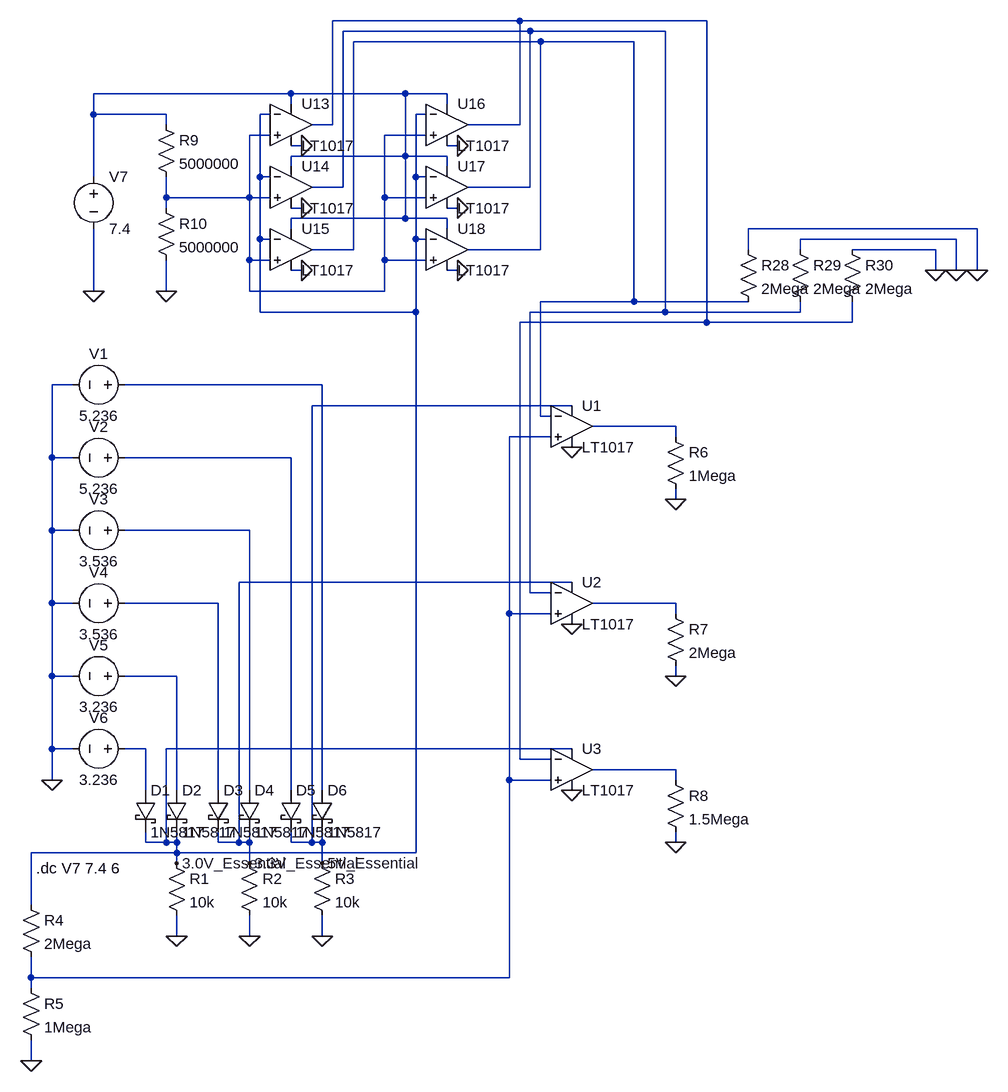
[diagram p0: schematic Cube_Sat_Power_Management_Revised.asc]
Cube_Sat_Power_Management_Revised.asc, the LTspice schematic file:
Version 4
SHEET 1 2600 2020
WIRE 656 -448 368 -448
WIRE 944 -448 656 -448
WIRE 672 -432 384 -432
WIRE 880 -432 672 -432
WIRE 688 -416 400 -416
WIRE 832 -416 688 -416
WIRE 304 -336 0 -336
WIRE 480 -336 304 -336
WIRE 544 -336 480 -336
WIRE 304 -320 304 -336
WIRE 544 -320 544 -336
WIRE 0 -304 0 -336
WIRE 112 -304 0 -304
WIRE 272 -304 256 -304
WIRE 512 -304 496 -304
WIRE 112 -288 112 -304
WIRE 368 -288 368 -448
WIRE 368 -288 336 -288
WIRE 656 -288 656 -448
WIRE 656 -288 576 -288
WIRE 272 -272 240 -272
WIRE 512 -272 448 -272
WIRE 320 -256 304 -256
WIRE 560 -256 544 -256
WIRE 480 -240 480 -336
WIRE 480 -240 304 -240
WIRE 544 -240 480 -240
WIRE 304 -224 304 -240
WIRE 544 -224 544 -240
WIRE 0 -208 0 -304
WIRE 256 -208 256 -304
WIRE 272 -208 256 -208
WIRE 496 -208 496 -304
WIRE 512 -208 496 -208
WIRE 384 -192 384 -432
WIRE 384 -192 336 -192
WIRE 672 -192 672 -432
WIRE 672 -192 576 -192
WIRE 112 -176 112 -208
WIRE 240 -176 240 -272
WIRE 240 -176 112 -176
WIRE 272 -176 240 -176
WIRE 448 -176 448 -272
WIRE 512 -176 448 -176
WIRE 112 -160 112 -176
WIRE 320 -160 304 -160
WIRE 560 -160 544 -160
WIRE 480 -144 480 -240
WIRE 480 -144 304 -144
WIRE 544 -144 480 -144
WIRE 304 -128 304 -144
WIRE 544 -128 544 -144
WIRE 1360 -128 1008 -128
WIRE 256 -112 256 -208
WIRE 272 -112 256 -112
WIRE 496 -112 496 -208
WIRE 512 -112 496 -112
WIRE 1328 -112 1088 -112
WIRE 400 -96 400 -416
WIRE 400 -96 336 -96
WIRE 688 -96 688 -416
WIRE 688 -96 576 -96
WIRE 1008 -96 1008 -128
WIRE 1088 -96 1088 -112
WIRE 1296 -96 1168 -96
WIRE 240 -80 240 -176
WIRE 272 -80 240 -80
WIRE 448 -80 448 -176
WIRE 512 -80 448 -80
WIRE 320 -64 304 -64
WIRE 560 -64 544 -64
WIRE 1296 -64 1296 -96
WIRE 1328 -64 1328 -112
WIRE 1360 -64 1360 -128
WIRE 0 -32 0 -128
WIRE 112 -32 112 -80
WIRE 240 -32 240 -80
WIRE 448 -32 448 -80
WIRE 448 -32 240 -32
WIRE 832 -16 832 -416
WIRE 832 -16 688 -16
WIRE 1008 -16 832 -16
WIRE 256 0 256 -112
WIRE 496 0 496 -112
WIRE 496 0 256 0
WIRE 880 0 880 -432
WIRE 880 0 672 0
WIRE 1088 0 1088 -16
WIRE 1088 0 880 0
WIRE 944 16 944 -448
WIRE 944 16 656 16
WIRE 1168 16 1168 -16
WIRE 1168 16 944 16
WIRE -32 112 -64 112
WIRE 352 112 48 112
WIRE 736 144 336 144
WIRE 688 160 688 -16
WIRE 704 160 688 160
WIRE 896 176 768 176
WIRE 704 192 640 192
WIRE 896 192 896 176
WIRE -64 224 -64 112
WIRE -32 224 -64 224
WIRE 304 224 48 224
WIRE 896 288 896 272
WIRE -64 336 -64 224
WIRE -32 336 -64 336
WIRE 240 336 48 336
WIRE 736 416 224 416
WIRE 672 432 672 0
WIRE 704 432 672 432
WIRE -64 448 -64 336
WIRE -32 448 -64 448
WIRE 192 448 48 448
WIRE 896 448 768 448
WIRE 640 464 640 192
WIRE 704 464 640 464
WIRE 896 464 896 448
WIRE -64 560 -64 448
WIRE -32 560 -64 560
WIRE 128 560 48 560
WIRE 896 560 896 544
WIRE -64 672 -64 560
WIRE -32 672 -64 672
WIRE 80 672 48 672
WIRE 736 672 112 672
WIRE 656 688 656 16
WIRE 704 688 656 688
WIRE 896 704 768 704
WIRE -64 720 -64 672
WIRE 640 720 640 464
WIRE 704 720 640 720
WIRE 896 720 896 704
WIRE 80 736 80 672
WIRE 128 736 128 560
WIRE 192 736 192 448
WIRE 240 736 240 336
WIRE 304 736 304 224
WIRE 352 736 352 112
WIRE 80 816 80 800
WIRE 112 816 112 672
WIRE 112 816 80 816
WIRE 128 816 128 800
WIRE 128 816 112 816
WIRE 192 816 192 800
WIRE 224 816 224 416
WIRE 224 816 192 816
WIRE 240 816 240 800
WIRE 240 816 224 816
WIRE 304 816 304 800
WIRE 336 816 336 144
WIRE 336 816 304 816
WIRE 352 816 352 800
WIRE 352 816 336 816
WIRE 896 816 896 800
WIRE 128 832 128 816
WIRE 128 832 -96 832
WIRE 496 832 496 0
WIRE 496 832 128 832
WIRE 128 848 128 832
WIRE 240 848 240 816
WIRE 352 848 352 816
WIRE -96 912 -96 832
WIRE 128 960 128 928
WIRE 240 960 240 928
WIRE 352 960 352 928
WIRE -96 1024 -96 992
WIRE 640 1024 640 720
WIRE 640 1024 -96 1024
WIRE -96 1040 -96 1024
WIRE -96 1152 -96 1120
FLAG -64 720 0
FLAG 320 -256 0
FLAG 320 -160 0
FLAG 320 -64 0
FLAG 560 -64 0
FLAG 560 -160 0
FLAG 560 -256 0
FLAG 112 -32 0
FLAG 0 -32 0
FLAG 1296 -64 0
FLAG 1328 -64 0
FLAG 1360 -64 0
FLAG 128 960 0
FLAG 240 960 0
FLAG 352 960 0
FLAG 352 848 5V_Essential
FLAG 240 848 3.3V_Essential
FLAG 128 848 3.0V_Essential
FLAG -96 1152 0
FLAG 736 208 0
FLAG 736 480 0
FLAG 736 736 0
FLAG 896 288 0
FLAG 896 560 0
FLAG 896 816 0
SYMBOL voltage 64 112 R90
WINDOW 0 -32 56 VBottom 2
WINDOW 3 32 56 VTop 2
WINDOW 123 0 0 Left 0
WINDOW 39 0 0 Left 0
SYMATTR InstName V1
SYMATTR Value 5.236
SYMBOL voltage 64 224 R90
WINDOW 0 -32 56 VBottom 2
WINDOW 3 32 56 VTop 2
WINDOW 123 0 0 Left 0
WINDOW 39 0 0 Left 0
SYMATTR InstName V2
SYMATTR Value 5.236
SYMBOL voltage 64 336 R90
WINDOW 0 -32 56 VBottom 2
WINDOW 3 32 56 VTop 2
WINDOW 123 0 0 Left 0
WINDOW 39 0 0 Left 0
SYMATTR InstName V3
SYMATTR Value 3.536
SYMBOL voltage 64 448 R90
WINDOW 0 -32 56 VBottom 2
WINDOW 3 32 56 VTop 2
WINDOW 123 0 0 Left 0
WINDOW 39 0 0 Left 0
SYMATTR InstName V4
SYMATTR Value 3.536
SYMBOL voltage 64 560 R90
WINDOW 0 -32 56 VBottom 2
WINDOW 3 32 56 VTop 2
WINDOW 123 0 0 Left 0
WINDOW 39 0 0 Left 0
SYMATTR InstName V5
SYMATTR Value 3.236
SYMBOL voltage 64 672 R90
WINDOW 0 -32 56 VBottom 2
WINDOW 3 32 56 VTop 2
WINDOW 123 0 0 Left 0
WINDOW 39 0 0 Left 0
SYMATTR InstName V6
SYMATTR Value 3.236
SYMBOL Comparators\\LT1017 304 -288 R0
SYMATTR InstName U13
SYMBOL Comparators\\LT1017 304 -192 R0
SYMATTR InstName U14
SYMBOL Comparators\\LT1017 304 -96 R0
SYMATTR InstName U15
SYMBOL Comparators\\LT1017 544 -288 R0
SYMATTR InstName U16
SYMBOL Comparators\\LT1017 544 -192 R0
SYMATTR InstName U17
SYMBOL Comparators\\LT1017 544 -96 R0
SYMATTR InstName U18
SYMBOL voltage 0 -224 R0
WINDOW 123 0 0 Left 0
WINDOW 39 0 0 Left 0
SYMATTR InstName V7
SYMATTR Value 7.4
SYMBOL res 96 -304 R0
SYMATTR InstName R9
SYMATTR Value 5000000
SYMBOL res 96 -176 R0
SYMATTR InstName R10
SYMATTR Value 5000000
SYMBOL schottky 64 736 R0
SYMATTR InstName D1
SYMATTR Value 1N5817
SYMATTR Description Diode
SYMATTR Type diode
SYMBOL schottky 112 736 R0
SYMATTR InstName D2
SYMATTR Value 1N5817
SYMATTR Description Diode
SYMATTR Type diode
SYMBOL schottky 176 736 R0
SYMATTR InstName D3
SYMATTR Value 1N5817
SYMATTR Description Diode
SYMATTR Type diode
SYMBOL schottky 224 736 R0
SYMATTR InstName D4
SYMATTR Value 1N5817
SYMATTR Description Diode
SYMATTR Type diode
SYMBOL schottky 288 736 R0
SYMATTR InstName D5
SYMATTR Value 1N5817
SYMATTR Description Diode
SYMATTR Type diode
SYMBOL schottky 336 736 R0
SYMATTR InstName D6
SYMATTR Value 1N5817
SYMATTR Description Diode
SYMATTR Type diode
SYMBOL res 992 -112 R0
SYMATTR InstName R28
SYMATTR Value 2Mega
SYMBOL res 1072 -112 R0
SYMATTR InstName R29
SYMATTR Value 2Mega
SYMBOL res 1152 -112 R0
SYMATTR InstName R30
SYMATTR Value 2Mega
SYMBOL res 112 832 R0
SYMATTR InstName R1
SYMATTR Value 10k
SYMBOL res 224 832 R0
SYMATTR InstName R2
SYMATTR Value 10k
SYMBOL res 336 832 R0
SYMATTR InstName R3
SYMATTR Value 10k
SYMBOL Comparators\\LT1017 736 176 R0
SYMATTR InstName U1
SYMBOL Comparators\\LT1017 736 448 R0
SYMATTR InstName U2
SYMBOL Comparators\\LT1017 736 704 R0
SYMATTR InstName U3
SYMBOL res -112 896 R0
SYMATTR InstName R4
SYMATTR Value 2Mega
SYMBOL res -112 1024 R0
SYMATTR InstName R5
SYMATTR Value 1Mega
SYMBOL res 880 176 R0
SYMATTR InstName R6
SYMATTR Value 1Mega
SYMBOL res 880 448 R0
SYMATTR InstName R7
SYMATTR Value 2Mega
SYMBOL res 880 704 R0
SYMATTR InstName R8
SYMATTR Value 1.5Mega
TEXT -88 856 Left 2 !.dc V7 7.4 6

The netlist it stands for:
* Cube_Sat_Power_Management_Revised.asc
V1 N006 0 5.236
V2 N009 0 5.236
V3 N010 0 3.536
V4 N011 0 3.536
V5 N013 0 3.236
V6 N014 0 3.236
XU13 N005 3.0V_Essential N004 0 N001 LT1017  ; pins In+ In- V+ V- OUT
XU14 N005 3.0V_Essential N004 0 N002 LT1017  ; pins In+ In- V+ V- OUT
XU15 N005 3.0V_Essential N004 0 N003 LT1017  ; pins In+ In- V+ V- OUT
XU16 N005 3.0V_Essential N004 0 N001 LT1017  ; pins In+ In- V+ V- OUT
XU17 N005 3.0V_Essential N004 0 N002 LT1017  ; pins In+ In- V+ V- OUT
XU18 N005 3.0V_Essential N004 0 N003 LT1017  ; pins In+ In- V+ V- OUT
V7 N004 0 7.4
R9 N004 N005 5000000
R10 N005 0 5000000
D1 N014 3.0V_Essential 1N5817
D2 N013 3.0V_Essential 1N5817
D3 N011 3.3V_Essential 1N5817
D4 N010 3.3V_Essential 1N5817
D5 N009 5V_Essential 1N5817
D6 N006 5V_Essential 1N5817
R28 0 N003 2Mega
R29 0 N002 2Mega
R30 0 N001 2Mega
R1 3.0V_Essential 0 10k
R2 3.3V_Essential 0 10k
R3 5V_Essential 0 10k
XU1 N008 N003 5V_Essential 0 N007 LT1017  ; pins In+ In- V+ V- OUT
XU2 N008 N002 3.3V_Essential 0 N012 LT1017  ; pins In+ In- V+ V- OUT
XU3 N008 N001 3.0V_Essential 0 N015 LT1017  ; pins In+ In- V+ V- OUT
R4 3.0V_Essential N008 2Mega
R5 N008 0 1Mega
R6 N007 0 1Mega
R7 N012 0 2Mega
R8 N015 0 1.5Mega
.model D D
.lib standard.dio
.dc V7 7.4 6
.backanno
.end